# EAGLE design battery_monitor_6803-2_Rev2 (EAGLE 7.3.0)
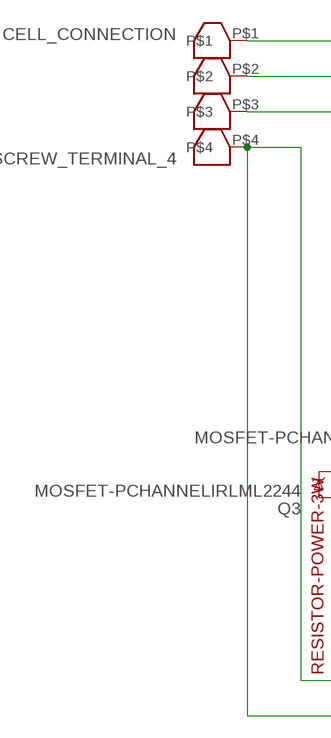
[diagram p0: schematic, sheet 1, part 1 of 2]
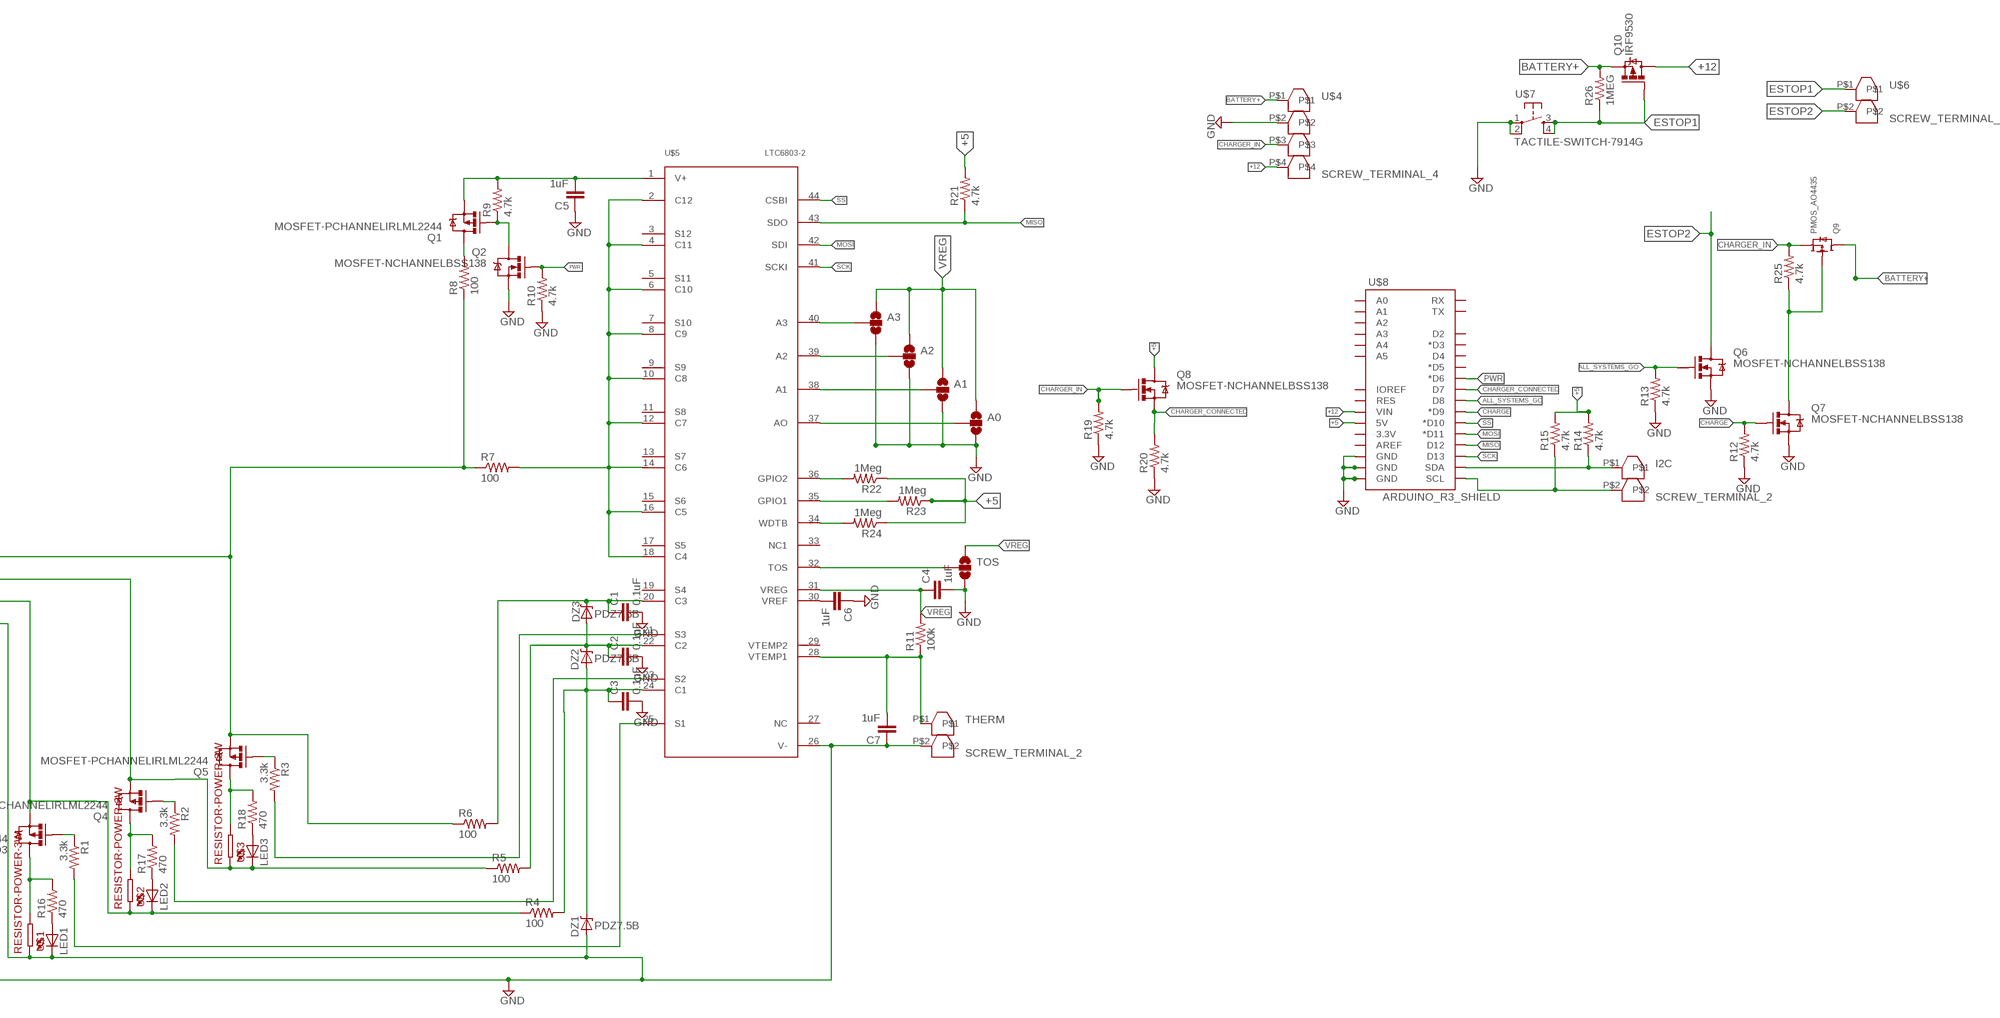
[diagram p1: schematic, sheet 1, part 2 of 2]

## Parts
A0  SOLDERJUMPER_2WAYS  [SJ_3]
A1  SOLDERJUMPER_2WAYS  [SJ_3]
A2  SOLDERJUMPER_2WAYS  [SJ_3]
A3  SOLDERJUMPER_2WAYS  [SJ_3]
C1  0.1uF  0.1UF-100V-10%(0603)  [0603-CAP]
C2  0.1uF  0.1UF-100V-10%(0603)  [0603-CAP]
C3  0.1uF  0.1UF-100V-10%(0603)  [0603-CAP]
C4  1uF  0.1UF-100V-10%(0603)  [0603-CAP]
C5  1uF  0.1UF-100V-10%(0603)  [0603-CAP]
C6  1uF  0.1UF-100V-10%(0603)  [0603-CAP]
C7  1uF  0.1UF-100V-10%(0603)  [0603-CAP]
CELL_CONNECTION  SCREW_TERMINAL_4  [SCREW_TERMINAL_4]
DZ1  PDZ7.5B  DIODE-ZENER-BZT52  [SOD-323]
DZ2  PDZ7.5B  DIODE-ZENER-BZT52  [SOD-323]
DZ3  PDZ7.5B  DIODE-ZENER-BZT52  [SOD-323]
I2C  SCREW_TERMINAL_2  [SCREW_TERMINAL_2]
LED1  LED0603  [LED-0603]
LED2  LED0603  [LED-0603]
LED3  LED0603  [LED-0603]
Q1  MOSFET-PCHANNELIRLML2244  [SOT23-3]
Q2  MOSFET-NCHANNELBSS138  [SOT23]
Q3  MOSFET-PCHANNELIRLML2244  [SOT23-3]
Q4  MOSFET-PCHANNELIRLML2244  [SOT23-3]
Q5  MOSFET-PCHANNELIRLML2244  [SOT23-3]
Q6  MOSFET-NCHANNELBSS138  [SOT23]
Q7  MOSFET-NCHANNELBSS138  [SOT23]
Q8  MOSFET-NCHANNELBSS138  [SOT23]
Q9  PMOS_AO4435  [SOIC8]
Q10  IRF9530  [TO220BV]
R1  3.3k  3.3KOHM1/10W1%(0603)  [0603-RES]
R2  3.3k  3.3KOHM1/10W1%(0603)  [0603-RES]
R3  3.3k  3.3KOHM1/10W1%(0603)  [0603-RES]
R4  100  3.3KOHM1/10W1%(0603)  [0603-RES]
R5  100  3.3KOHM1/10W1%(0603)  [0603-RES]
R6  100  3.3KOHM1/10W1%(0603)  [0603-RES]
R7  100  3.3KOHM1/10W1%(0603)  [0603-RES]
R8  100  3.3KOHM1/10W1%(0603)  [0603-RES]
R9  4.7k  3.3KOHM1/10W1%(0603)  [0603-RES]
R10  4.7k  3.3KOHM1/10W1%(0603)  [0603-RES]
R11  100k  3.3KOHM1/10W1%(0603)  [0603-RES]
R12  4.7k  3.3KOHM1/10W1%(0603)  [0603-RES]
R13  4.7k  3.3KOHM1/10W1%(0603)  [0603-RES]
R14  4.7k  3.3KOHM1/10W1%(0603)  [0603-RES]
R15  4.7k  3.3KOHM1/10W1%(0603)  [0603-RES]
R16  470  3.3KOHM1/10W1%(0603)  [0603-RES]
R17  470  3.3KOHM1/10W1%(0603)  [0603-RES]
R18  470  3.3KOHM1/10W1%(0603)  [0603-RES]
R19  4.7k  3.3KOHM1/10W1%(0603)  [0603-RES]
R20  4.7k  3.3KOHM1/10W1%(0603)  [0603-RES]
R21  4.7k  3.3KOHM1/10W1%(0603)  [0603-RES]
R22  1Meg  3.3KOHM1/10W1%(0603)  [0603-RES]
R23  1Meg  3.3KOHM1/10W1%(0603)  [0603-RES]
R24  1Meg  3.3KOHM1/10W1%(0603)  [0603-RES]
R25  4.7k  3.3KOHM1/10W1%(0603)  [0603-RES]
R26  1MEG  3.3KOHM1/10W1%(0603)  [0603-RES]
THERM  SCREW_TERMINAL_2  [SCREW_TERMINAL_2]
TOS  SOLDERJUMPER_2WAYS  [SJ_3]
U$1  RESISTOR-POWER-3W  [RESISTOR-3W]
U$2  RESISTOR-POWER-3W  [RESISTOR-3W]
U$3  RESISTOR-POWER-3W  [RESISTOR-3W]
U$4  SCREW_TERMINAL_4  [SCREW_TERMINAL_4]
U$5  LTC6803-2  [FSOP-44]
U$6  SCREW_TERMINAL_2  [SCREW_TERMINAL_2]
U$7  TACTILE-SWITCH-7914G  [7914G]
U$8  ARDUINO_R3_SHIELD  [UNO_R3_SHIELD]

## Nets
+5: Q8.3(D) R14.2 R15.2 R21.2 R22.1 R23.1 R24.1 U$8.5V
+12: Q10.D U$4.P$4 U$8.VIN
ALL_SYSTEMS_GO: Q6.1(G) R13.2 U$8.D8
BATTERY+: Q9.5(DRAIN) Q9.6(DRAIN) Q9.7(DRAIN) Q9.8(DRAIN) Q10.S R26.2 U$4.P$1
CHARGE: Q7.1(G) R12.2 U$8.D9(*D9)
CHARGER_CONNECTED: Q8.2(S) R20.2 U$8.D7
CHARGER_IN: Q8.1(G) Q9.1(SOURCE) Q9.2(SOURCE) Q9.3(SOURCE) R19.2 R25.2 U$4.P$3
ESTOP1: Q10.G R26.1 U$6.P$1 U$7.3 U$7.4
ESTOP2: Q6.3(D) U$6.P$2
GND: A0.3 A1.3 A2.3 A3.3 C1.2 C2.2 C3.2 C4.2 C5.1 C6.1 C7.1 CELL_CONNECTION.P$4 DZ1.2(A) LED1.C Q2.2(S) Q6.2(S) Q7.2(S) R10.1 R12.1 R13.1 R19.1 R20.1 THERM.P$2 TOS.3 U$1.P$2 U$4.P$2 U$5.26(V-) U$7.1 U$7.2 U$8.GND@0(GND) U$8.GND@1(GND) U$8.GND@2(GND)
MISO: R21.1 U$5.43(SDO) U$8.D12
MOSI: U$5.42(SDI) U$8.D11(*D11)
N$1: Q7.3(D) Q9.4(GATE) R25.1
N$2: CELL_CONNECTION.P$3 LED2.C Q3.2(S) R4.1 U$2.P$2
N$3: CELL_CONNECTION.P$2 LED3.C Q4.2(S) R5.1 U$3.P$2
N$4: CELL_CONNECTION.P$1 Q5.2(S) R6.1 R7.1 R8.1
N$5: Q3.3(D) R16.2 U$1.P$1
N$6: R2.2 U$5.23(S2)
N$7: Q3.1(G) R1.1
N$8: R1.2 U$5.25(S1)
N$9: R3.2 U$5.21(S3)
N$10: Q4.3(D) R17.2 U$2.P$1
N$11: Q4.1(G) R2.1
N$12: Q5.3(D) R18.2 U$3.P$1
N$13: LED1.A R16.1
N$14: C1.1 DZ3.1(C) R6.2 U$5.20(C3)
N$15: C3.1 DZ1.1(C) DZ2.2(A) R4.2 U$5.24(C1)
N$16: C2.1 DZ2.1(C) DZ3.2(A) R5.2 U$5.22(C2)
N$17: R7.2 U$5.2(C12) U$5.4(C11) U$5.6(C10) U$5.8(C9) U$5.10(C8) U$5.12(C7) U$5.14(C6) U$5.16(C5) U$5.18(C4)
N$18: Q1.3(D) R8.2
N$19: C5.2 Q1.2(S) R9.2 U$5.1(V+)
N$20: Q1.1(G) Q2.3(D) R9.1
N$21: C7.2 R11.1 THERM.P$1 U$5.28(VTEMP1)
N$22: LED2.A R17.1
N$23: LED3.A R18.1
N$24: R22.2 U$5.36(GPIO2)
N$25: R23.2 U$5.35(GPIO1)
N$27: R24.2 U$5.34(WDTB)
N$28: A3.2 U$5.40(A3)
N$29: Q5.1(G) R3.1
N$30: A2.2 U$5.39(A2)
N$31: A1.2 U$5.38(A1)
N$32: A0.2 U$5.37(AO)
N$33: TOS.2 U$5.32(TOS)
N$34: C6.2 U$5.30(VREF)
PWR: Q2.1(G) R10.2 U$8.D6(*D6)
SCK: U$5.41(SCKI) U$8.D13
SCL: I2C.P$2 R15.1 U$8.SCL
SDA: I2C.P$1 R14.1 U$8.SDA
SS: U$5.44(CSBI) U$8.D10(*D10)
VREG: A0.1 A1.1 A2.1 A3.1 C4.1 R11.2 TOS.1 U$5.31(VREG)
Unconnected: U$5.3(S12) U$5.5(S11) U$5.7(S10) U$5.9(S9) U$5.11(S8) U$5.13(S7) U$5.15(S6) U$5.17(S5) U$5.19(S4) U$5.27(NC) U$5.29(VTEMP2) U$5.33(NC1) U$8.3.3V U$8.A0 U$8.A1 U$8.A2 U$8.A3 U$8.A4 U$8.A5 U$8.AREF U$8.D2 U$8.D3(*D3) U$8.D4 U$8.D5(*D5) U$8.IOREF U$8.RES U$8.RX U$8.TX

## Library data of the parts
A0 A1-A3 TOS = SparkFun:SOLDERJUMPER_2WAY: Solder Jumper 2 way solder jumper; OC_NEWARK: unknown
C1-C3 = SparkFun-Capacitors:0.1UF-100V-10%(0603): CAP-08390; MF: AVX CORPORATION; MPN: 0603YG104ZAT2A; OC_NEWARK: 01H6821; PROD_ID: CAP-08390
C4-C7 = SparkFun-Capacitors:0.1UF-100V-10%(0603): CAP-08390; MPN: C0603X5R0J105M030BC; OC_NEWARK: 04X3184; PROD_ID: CAP-08390; VALUE: 0.1uF
CELL_CONNECTION U$4 = isaac1:SCREW_TERMINAL_4; MF: TYCO ELECTRONICS; MPN: 282834-4; OC_NEWARK: 12H8388
DZ1-DZ3 = SparkFun-DiscreteSemi:DIODE-ZENER: Zener Diode Production Part - 8199 3.4V Zener Voltage; MPN: PDZ7.5B,115; OC_NEWARK: 04X4941
I2C THERM = isaac1:SCREW_TERMINAL_2; MF: TYCO ELECTRONICS; MPN: 282834-2; OC_NEWARK: 12H8386
LED1-LED3 = SparkFun-LED:LED: LEDs Standard schematic elements and footprints for 5mm, 3mm, 1206, and 0603 sized LEDs. 5mm - Spark Fun Electronics SKU : COM-00529 (and others); MPN: 150060RS75000; OC_NEWARK: 95W3795
Q1 Q3-Q5 = SparkFun-DiscreteSemi:MOSFET-PCHANNEL: Generic PMOSFET; MPN: SI2369DS-T1-GE3; OC_NEWARK: 40X8697; PROD_ID: TRANS-11153
Q2 Q6-Q8 = SparkFun-DiscreteSemi:MOSFET-NCHANNEL: Common NMOSFET Parts MFG P/N Store ID Prod ID FDD8780 TRANS-09984 SI7820DN TRANS-11055 FDS6630A IC-08089 2N7002PW TRANS-11151 FQP30N06L COM-10213 TRANS-10060 BSS123LT1G TRANS-08345 BSS138 TRANS-00830 BS170 2N7000; MPN: IRLML0030TRPBF; OC_NEWARK: 52R2613; PROD_ID: TRANS-00830
Q9 = isaac1:PMOS_AO4435; MPN: SI9407BDY-T1-GE3; OC_NEWARK: 16P3885
Q10 = Adams Chips:IRF9530: P-CHANNEL HEXFET POWER-MOS-FET Source: http://www.irf.com/product-info/datasheets/data/irf9530.pdf; MPN: NTE2383; OC_NEWARK: 14T4215
R1-R3 = SparkFun-Resistors:3.3KOHM1/10W1%(0603): RES-07851; MF: VISHAY/DALE; MPN: CRCW06033K00FKEA; OC_NEWARK: 52K8368; PROD_ID: RES-07851
R4-R8 = SparkFun-Resistors:3.3KOHM1/10W1%(0603): RES-07851; MPN: ERJ-1GNF1000C; OC_NEWARK: 05X8794; PROD_ID: RES-07851
R9 R10 R12-R15 R19-R21 R25 = SparkFun-Resistors:3.3KOHM1/10W1%(0603): RES-07851; MF: VISHAY/DALE; MPN: CRCW06034K70FKEA; OC_NEWARK: 52K8494; PROD_ID: RES-07851
R11 = SparkFun-Resistors:3.3KOHM1/10W1%(0603): RES-07851; MF: FARNELL; MPN: MC0063W06035100K; OC_NEWARK: 39K0075; PROD_ID: RES-07851
R16-R18 = SparkFun-Resistors:3.3KOHM1/10W1%(0603): RES-07851; MPN: ERJ-P03F4700V; OC_NEWARK: 05X8640; PROD_ID: RES-07851
R22-R24 R26 = SparkFun-Resistors:3.3KOHM1/10W1%(0603): RES-07851; MPN: ERJ-3EKF1004V; OC_NEWARK: 64R5311; PROD_ID: RES-07851
U$1-U$3 = isaac1:RESISTOR-POWER-3W: PR03 series .205" dia x .657" L; MPN: ERG-3SJ200; OC_NEWARK: 52W7905
U$5 = isaac1:LTC6803-2; OC_NEWARK: unknown
U$6 = Isaac:SCREW_TERMINAL_2; MF: TYCO ELECTRONICS; MPN: 282834-2; OC_NEWARK: 12H8386
U$7 = GeekAmmo:TACTILE-SWITCH: Tactile Switch 4 Pins, SPST NO; MF: BOURNS, INC.; MPN: 7914G-1-000E; OC_NEWARK: 05B2757
U$8 = SparkFun-Boards:ARDUINO_R3_SHIELD: Shield form compatible with the Arduino Uno R3.; OC_NEWARK: unknown

## Board
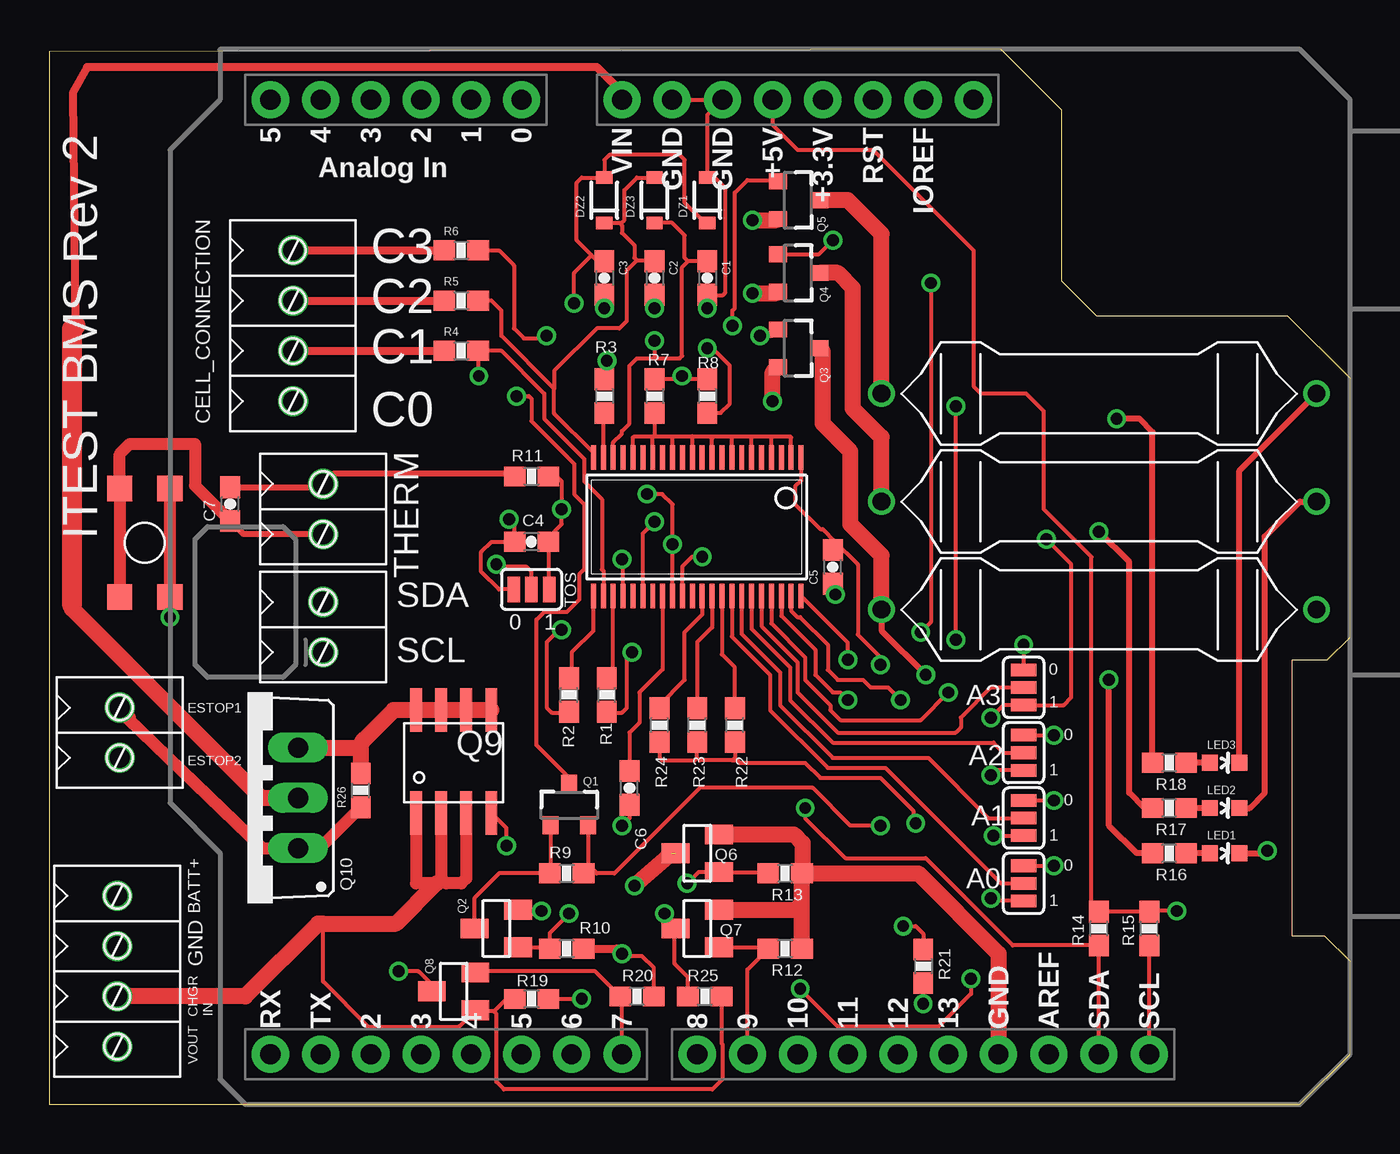
[diagram p2: board, top side]
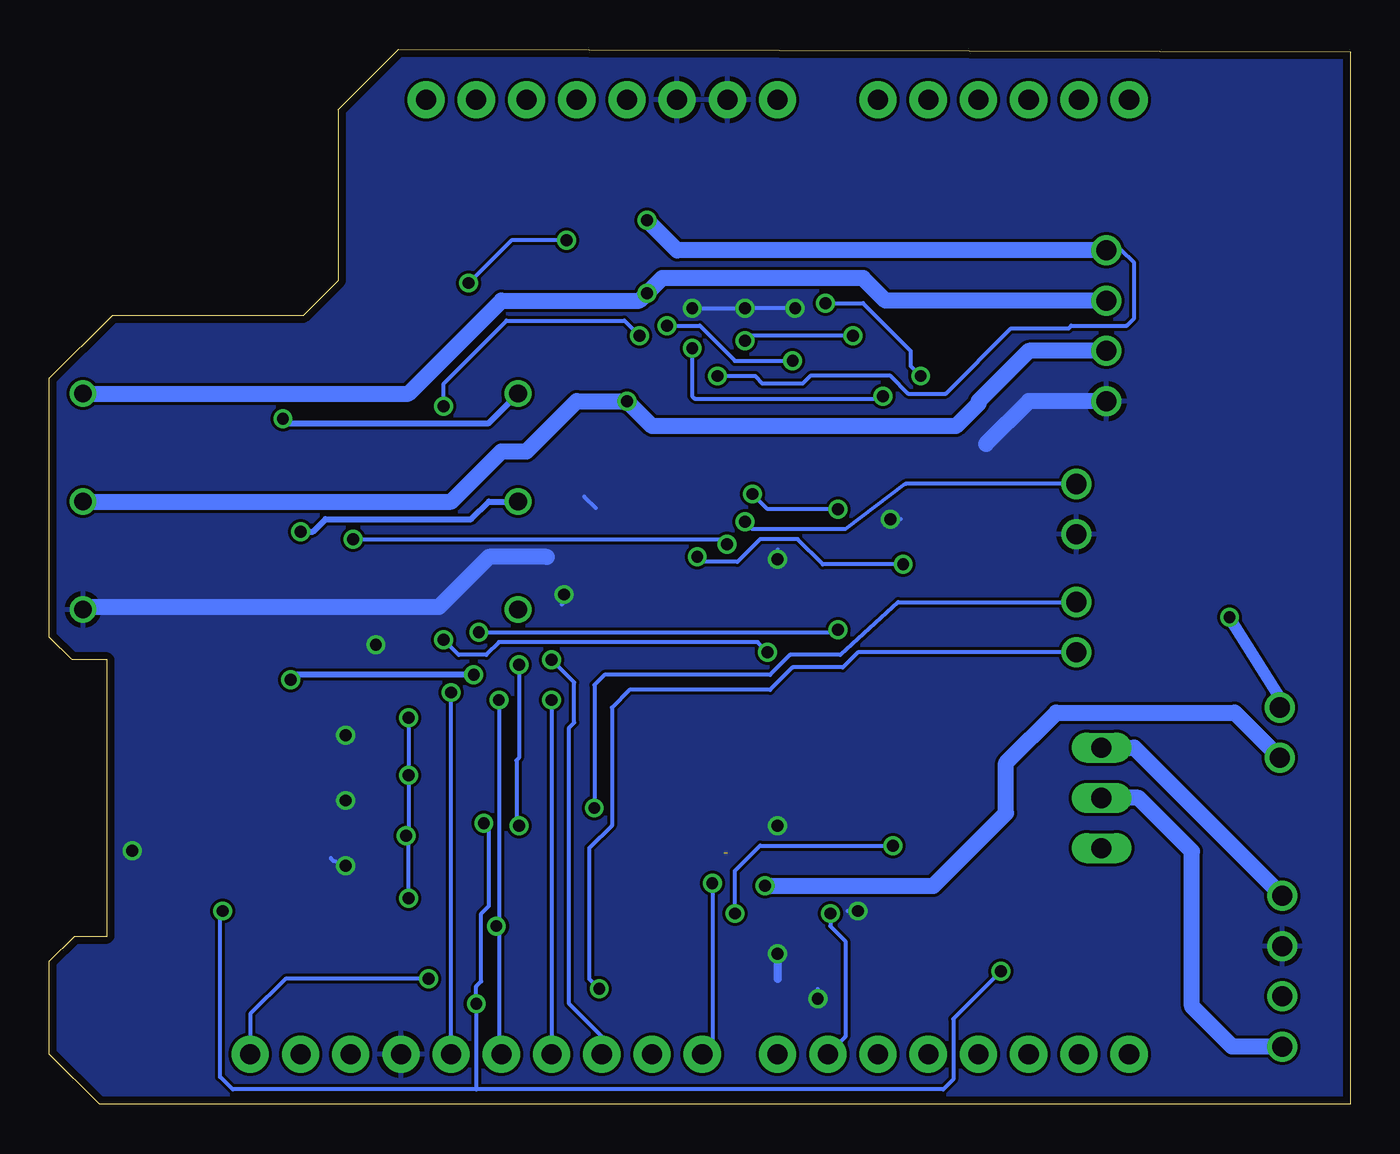
[diagram p3: board, bottom side, seen from below]

Size 65.79 x 53.34 mm. Coordinates in mm from the lower left corner, seen from the top.
Outline: 0,0 63.25,0 65.79,2.54 65.79,7.24 64.52,8.51 62.86,8.51 62.86,22.48 64.64,22.48 65.79,23.62 65.79,36.7 62.61,39.88 52.96,39.88 51.18,41.66 51.18,50.29 48.13,53.34 0,53.21 0,0
Copper layers (1*16): Top 0.0356mm / dielectric 1.5011mm / Bottom 0.0356mm
Design rules "LaenPCBOrder": minimum track width 6mil, minimum drill 13mil, track to track 6mil, track to pad 6mil, pad to pad 6mil, via to via 6mil, smd to smd 6mil, copper to edge 15mil, drill to drill 6mil, minimum pad ring 7mil, minimum via ring 7mil, stop-mask expansion 3mil, vias tented up to drill 0mil, thermal gap 10mil

### Footprints (pad centres in the part's own frame; a part is rotated, then mirrored left to right if it is on the bottom)
SJ_3 = smd 0.635 x 1.27: 1 -0.889,0; 2 0,0; 3 0.889,0
0603-CAP = smd 1.1 x 1: 1 -0.85,0; 2 0.85,0
SCREW_TERMINAL_4 = drill 1.016 pad 1.422: P$1 0,3.81; P$2 0,1.27; P$3 0,-1.27; P$4 0,-3.81
SOD-323 = smd 0.63 x 0.83: 1 -1.15,0; 2 1.15,0
SCREW_TERMINAL_2 = drill 1.016 pad 1.422: P$1 0,1.27; P$2 0,-1.27
LED-0603 = smd 0.8 x 0.8: A 0,-0.75; C 0,0.75
SOT23-3 = smd 0.8 x 0.9: 1 -0.95,-1; 2 0.95,-1; 3 0,1.1
SOT23 = smd 1 x 1.4: 1 -0.95,-1.1; 2 0.95,-1.1; 3 0,1.1
SOIC8 = smd 0.6 x 2.2: 1 -1.905,-2.54; 2 -0.635,-2.54; 3 0.635,-2.54; 4 1.905,-2.54; 5 1.905,2.66; 6 0.635,2.66; 7 -0.635,2.66; 8 -1.905,2.66
TO220BV = drill 1.016 long: D 0,-2.54; G -2.54,-2.54; S 2.54,-2.54
0603-RES = smd 1.1 x 1: 1 -0.85,0; 2 0.85,0
RESISTOR-3W = drill 0.9: P$1 0,11; P$2 0,-11
FSOP-44 = smd 0.25 x 1.25: 1 -5.25,-3.5; 2 -4.75,-3.5; 3 -4.25,-3.5; 4 -3.75,-3.5; 5 -3.25,-3.5; 6 -2.75,-3.5; 7 -2.25,-3.5; 8 -1.75,-3.5; 9 -1.25,-3.5; 10 -0.75,-3.5; 11 -0.25,-3.5; 12 0.25,-3.5; 13 0.75,-3.5; 14 1.25,-3.5; 15 1.75,-3.5; 16 2.25,-3.5; 17 2.75,-3.5; 18 3.25,-3.5; 19 3.75,-3.5; 20 4.25,-3.5; 21 4.75,-3.5; 22 5.25,-3.5; 23 5.25,3.5; 24 4.75,3.5; 25 4.25,3.5; 26 3.75,3.5; 27 3.25,3.5; 28 2.75,3.5; 29 2.25,3.5; 30 1.75,3.5; 31 1.25,3.5; 32 0.75,3.5; 33 0.25,3.5; 34 -0.25,3.5; 35 -0.75,3.5; 36 -1.25,3.5; 37 -1.75,3.5; 38 -2.25,3.5; 39 -2.75,3.5; 40 -3.25,3.5; 41 -3.75,3.5; 42 -4.25,3.5; 43 -4.75,3.5; 44 -5.25,3.5
7914G = smd 1.27 x 1.27: 1 0,0; 2 0,5.486; 3 2.54,0; 4 2.54,5.486
UNO_R3_SHIELD = drill 1.016 pad 1.88: 3.3V 50.8,26.67; 5V 50.8,29.21; A0 50.8,41.91; A1 50.8,44.45; A2 50.8,46.99; A3 50.8,49.53; A4 50.8,52.07; A5 50.8,54.61; AREF 2.54,15.24; D2 2.54,49.53; D3 2.54,46.99; D4 2.54,44.45; D5 2.54,41.91; D6 2.54,39.37; D7 2.54,36.83; D8 2.54,33.02; D9 2.54,30.48; D10 2.54,27.94; D11 2.54,25.4; D12 2.54,22.86; D13 2.54,20.32; GND@0 50.8,31.75; GND@1 50.8,34.29; GND@2 2.54,17.78; IOREF 50.8,21.59; NC 50.8,19.05; RES 50.8,24.13; RX 2.54,54.61; SCL 2.54,10.16; SDA 2.54,12.7; TX 2.54,52.07; VIN 50.8,36.83

### Placement (x,y rotation side)
A0  49.28,11.18 90 top
A1  49.28,14.48 90 top
A2  49.28,17.78 90 top
A3  49.28,21.08 90 top
C1  33.27,41.78 270 top
C2  30.61,41.78 270 top
C3  28.07,41.78 270 top
C4  24.38,28.45 180 top
C5  39.62,27.18 90 top
C6  29.34,16 90 top
C7  9.14,30.35 90 top
CELL_CONNECTION  12.32,39.37 0 top
DZ1  33.27,45.72 90 top
DZ2  28.07,45.72 90 top
DZ3  30.61,45.72 90 top
I2C  13.84,24.13 0 top
LED1  59.44,12.7 270 top
LED2  59.44,14.99 270 top
LED3  59.44,17.27 270 top
Q1  26.29,15.11 0 top
Q2  22.61,8.89 90 top
Q3  37.85,38.23 270 top
Q4  37.85,42.04 270 top
Q5  37.85,45.72 270 top
Q6  32.77,12.7 90 top
Q7  32.77,8.89 90 top
Q8  20.45,5.71 90 top
Q9  20.45,17.27 0 top
Q10  10.03,15.49 90 top
R1  28.19,20.7 90 top
R2  26.29,20.7 90 top
R3  28.07,35.81 270 top
R4  20.83,38.1 0 top
R5  20.83,40.64 0 top
R6  20.83,43.18 0 top
R7  30.61,35.81 270 top
R8  33.27,35.81 270 top
R9  26.16,11.68 0 top
R10  26.16,7.87 180 top
R11  24.38,31.75 0 top
R12  37.21,7.87 180 top
R13  37.21,11.68 180 top
R14  53.09,8.89 90 top
R15  55.63,8.89 90 top
R16  56.64,12.7 180 top
R17  56.64,14.99 180 top
R18  56.64,17.27 180 top
R19  24.38,5.33 180 top
R20  29.72,5.46 180 top
R21  44.2,6.98 270 top
R22  34.67,19.18 90 top
R23  32.77,19.18 90 top
R24  30.86,19.18 90 top
R25  33.15,5.46 0 top
R26  15.75,15.88 90 top
THERM  13.84,30.1 0 top
TOS  24.38,26.04 180 top
U$1  53.09,25.02 90 top
U$2  53.09,30.48 90 top
U$3  53.09,35.94 90 top
U$4  3.43,6.73 0 top
U$5  32.77,29.21 180 top
U$6  3.56,18.8 0 top
U$7  3.56,25.65 0 top
U$8  65.79,0 90 top

### Tracks (layer width: path | path; a pad name or v marks a point on that pad's centre or on a via)
+5  (via drill 0.6)
  Top 0.203: U$8.5V 36.58,49.53 37.85,48.26 41.66,48.26 46.74,43.18 46.74,36.32 47.12,35.94 49.4,35.94 50.29,35.05 50.29,30.1 52.7,27.69 52.7,10.12 R14.2 R15.2 55.66,9.78 v57.02,9.78 | Q8.3 19.35,6.05 18.67,6.73 v17.65,6.73 | R21.2 v44.2,5.08 | R24.1 30.86,17.53 30.99,17.4 32.64,17.4 32.77,17.53 | 32.77,17.53 R23.1 | R22.1 34.67,17.53 34.54,17.4 | 34.54,17.4 32.89,17.4 32.77,17.53 | 34.54,17.4 34.8,17.4 34.92,17.27 38.23,17.27 38.99,16.51 42.04,16.51 43.69,14.86 43.69,14.35 v43.81,14.22
  Bottom 0.203: v57.02,9.78 57.15,9.65 57.15,1.4 56.52,0.76 44.2,0.76 | 44.2,0.76 20.57,0.76 20.07,1.27 20.07,4.32 v17.65,6.73 | 44.2,0.76 v44.2,5.08 44.2,5.97 43.94,6.22 43.94,9.65 43.56,10.03 43.56,13.97 v43.81,14.22
+12
  Top 0.406: U$8.VIN 28.96,51.18 27.69,52.45 1.9,52.45 1.19,51.14 1.31,39.37
  Top 0.813: Q10.D 10.71,15.49 1.14,25.06 1.14,25.27
  Top 1.016: 1.14,25.27 1.14,39.2 1.31,39.37
  Bottom 0.813: U$4.P$4 5.97,2.92 8,4.95 8,12.79 10.71,15.49 Q10.D
ALL_SYSTEMS_GO  (via drill 0.6)
  Top 0.203: 36.3,11.75 Q6.1 32.83,11.75 v32.26,11.18
  Top 0.813: 36.3,11.75 R13.2
  Bottom 0.203: v32.26,11.18 32.26,3.05 U$8.D8
BATTERY+
  Top 0.813: Q9.5 Q9.6 Q9.7 Q9.8 arc45 18.52,19.94 17.4,19.94 15.93,18.47 arc45 15.75,18.02 | 15.75,18.02 R26.2 | Q10.S arc45 12.59,18.02 15.75,18.02
  Bottom 0.813: Q10.S 10.92,18.03 U$4.P$1
CHARGE
  Top 0.203: Q7.1 36.3,7.94 R12.2 35.31,6.82 U$8.D9
CHARGER_CONNECTED
  Top 0.203: U$8.D7 28.96,5.37 R20.2 27.6,6.73 21.61,6.73 Q8.2
CHARGER_IN
  Top 0.203: R19.2 23.11,5.33 22.48,4.7 | 22.48,4.7 21.61,4.7 Q8.1 | R25.2 34,3.09 34.04,3.05 34.04,1.27 33.53,0.76 22.99,0.76 22.61,1.14 22.61,4.57 22.48,4.7 | Q8.1 21.49,4.83 | 13.84,9.14 13.84,6.22 16.13,3.94 20.72,3.94 Q8.1
  Top 0.406: 21.49,4.83 21.46,4.83
  Top 0.61: Q9.1 18.54,11.18 19.56,11.18 19.81,11.43 | Q9.2 19.81,11.43 | Q9.3 21.08,11.43 20.83,11.18 20.07,11.18 19.81,11.43
  Top 0.813: U$4.P$3 9.91,5.46 13.59,9.14 13.84,9.14 17.53,9.14 19.56,11.18
ESTOP1  (via drill 0.6)
  Top 0.61: R26.1 13.68,12.95 Q10.G 10.8,12.95 3.94,19.56 4.06,19.56 U$6.P$1 | U$7.4 U$7.3 v6.1,24.64
  Bottom 0.61: U$6.P$1 3.56,20.57 v6.1,24.64
ESTOP2  (via drill 0.6)  (1 unrouted)
  Top 0.813: 31.5,12.7 v29.59,11.05
  Bottom 0.61: U$6.P$2 3.81,17.78
  Bottom 0.813: U$6.P$2 5.84,19.81 14.86,19.81 17.4,17.27 17.4,14.73 21.08,11.05 v29.59,11.05
GND  (via drill 0.6)
  Top 0.203: C3.2 v28.07,40.26 | v30.61,40.26 C2.2 | v33.27,40.26 C1.2 33.31,40.89 34.04,40.89 34.16,41.02 34.16,46.35 33.65,46.87 DZ1.2 33.27,50.04 U$8.GND@0 U$8.GND@1 | Q2.2 23.89,9.65 24.77,9.65 v24.89,9.78 | R19.1 v26.92,5.33 | R20.1 30.57,6.9 29.97,7.49 29.08,7.49 v28.96,7.62 | U$5.26 29.02,27.5 v28.96,27.56 | A0.3 v50.8,12.06 | A1.3 v50.8,15.37 | A2.3 v50.8,18.67 | A3.3 v49.28,23.24 | C5.1 39.62,25.91 v39.75,25.78 | v23.24,29.59 23.53,29.3 C4.2 22.35,28.45 21.84,27.94 21.84,26.92 22.73,26.04 TOS.3 | C6.1 29.34,14.48 v28.96,14.1
  Top 0.305: LED1.C 61.47,12.7 v61.59,12.83 | THERM.P$2 9.82,28.83 C7.1
  Top 0.406: R10.1 28.7,7.87 v28.96,7.62
  Top 0.61: U$7.1 U$7.2 3.56,32.89 4.06,33.4 7.37,33.4 7.37,31.28 C7.1
  Top 0.813: R13.1 43.94,11.68 48.01,7.62 U$8.GND@2 | R12.1 38.06,10.16 | 38.06,10.16 R13.1 | Q7.2 37.74,9.84 38.06,10.16 | Q6.2 37.66,13.65 38.1,13.21 38.1,11.72 R13.1
  Bottom 0.203: v28.07,40.26 v30.61,40.26 v33.27,40.26 | 38.73,30.73 38.16,30.16 | v26.92,5.33 26.92,5.84 | v28.96,27.56 28.96,28.07 | v50.8,12.06 51.44,12.32 51.56,12.45 | v50.8,15.37 51.18,15.37 | v50.8,18.67 50.93,18.67 50.8,18.8 | v49.28,23.24 49.28,23.62 | v39.75,25.78 39.75,25.4 39.88,25.27 | v23.24,29.59 22.73,29.59 | v28.96,14.1 28.96,13.72 | v24.89,9.78 25.4,9.78
  Bottom 0.406: v28.96,7.62 28.96,6.35
  Bottom 0.813: CELL_CONNECTION.P$4 16.26,35.56 18.41,33.4 | 40.64,27.69 43.56,27.69 46.1,25.15 63.96,25.15 U$1.P$2
  pour Bottom: -0.89,-1.02 65.79,-1.27 65.79,54.61 -0.89,54.61
MISO  (via drill 0.6)
  Top 0.203: v43.05,20.45 42.42,21.08 41.53,21.08 41.15,21.46 39.88,21.46 39.37,21.97 39.37,23.24 37.97,24.64 37.85,24.64 37.52,24.97 U$5.43 | v43.18,9.02 43.81,9.02 44.2,8.64 R21.1
  Bottom 0.203: v43.05,20.45 43.05,9.14 | 43.05,9.14 43.05,2.67 U$8.D12 | v43.18,9.02 43.05,9.14
MOSI  (via drill 0.6)
  Top 0.203: v40.39,20.45 40.01,20.83 39.62,20.83 38.73,21.72 38.73,22.99 37.02,24.71 U$5.42
  Bottom 0.203: v40.39,20.45 U$8.D11
N$1  (via drill 0.6)
  Top 0.203: R25.1 32.3,6.44 31.62,7.11 31.62,8.85 | 31.62,8.85 Q7.3 | 31.62,8.85 31.62,9.14 v31.12,9.65 | v23.11,13.08 23.11,13.97 Q9.4
  Bottom 0.203: v31.12,9.65 31.12,11.81 29.84,13.08 v23.11,13.08
N$2  (via drill 0.6)
  Top 0.305: LED2.C 60.71,14.99 61.47,15.75 61.47,28.7 63.25,30.48 U$2.P$2
  Top 0.406: CELL_CONNECTION.P$3 R4.1
  Top 0.813: v36.58,35.56 36.58,37.01 Q3.2
  Bottom 0.813: CELL_CONNECTION.P$3 16.26,38.1 18.8,35.56 18.8,35.43 19.94,34.29 35.31,34.29 v36.58,35.56 39.12,35.56 41.66,33.02 42.93,33.02 45.47,30.48 U$2.P$2
N$3  (via drill 0.6)
  Top 0.305: LED3.C 60.19,32.04 U$3.P$2
  Top 0.406: CELL_CONNECTION.P$2 R5.1
  Top 0.813: v35.56,41.02 36.78,41.02 Q4.2
  Bottom 0.813: CELL_CONNECTION.P$2 23.49,40.64 24.64,41.78 34.8,41.78 v35.56,41.02 | 35.43,41.15 v35.56,41.02 | U$3.P$2 47.62,35.94 42.93,40.64 35.94,40.64 v35.56,41.02
N$4  (via drill 0.6)
  Top 0.203: R7.1 R8.1 32.17,36.66 v32,36.83
  Top 0.406: CELL_CONNECTION.P$1 R6.1
  Top 0.813: v35.56,44.7 36.78,44.7 Q5.2
  Bottom 0.203: v32,36.83 30.1,36.83 29.72,36.45 27.69,36.45 27.3,36.83 23.24,36.83 22.35,35.94 20.45,35.94 17.14,39.24 14.22,39.24 14.1,39.37 11.3,39.37 10.92,39.75 10.92,42.55 11.56,43.18 CELL_CONNECTION.P$1
  Bottom 0.813: CELL_CONNECTION.P$1 34.04,43.18 v35.56,44.7
N$5  (via drill 0.6)
  Top 0.305: R16.2 54.99,12.7 53.59,14.1 v53.59,21.46 | U$1.P$1 42.09,23.95 v44.32,21.72
  Top 0.813: U$1.P$1 42.09,27.76 40.51,29.34 40.51,33.02 39.12,34.42 39.12,38.06 Q3.3
  Bottom 0.305: v44.32,21.72 53.34,21.72 v53.59,21.46
N$6
  Top 0.203: R2.2 26.42,21.68 26.42,22.86 27.52,23.96 U$5.23
N$7  (via drill 0.6)
  Top 0.203: v45.85,23.5 v45.85,35.31 | v35.94,38.86 36.53,38.86 Q3.1 | R1.1 28.49,19.81 28.96,19.81 29.21,20.07 29.21,22.61 v29.46,22.86
  Bottom 0.203: v45.85,23.5 45.09,22.73 43.69,22.73 43.05,23.37 29.97,23.37 v29.46,22.86 | v45.85,35.31 45.85,36.45 42.67,39.62 36.7,39.62 v35.94,38.86
N$8
  Top 0.203: R1.2 28.52,21.62 U$5.25
N$9
  Top 0.203: U$5.21 28.02,34.91 R3.2
N$10  (via drill 0.6)
  Top 0.305: R17.2 55.37,14.99 54.61,15.75 54.61,27.43 v53.09,28.96
  Top 0.813: U$2.P$1 42.09,33.73 40.64,35.18 40.64,41.27 39.88,42.04 Q4.3
  Bottom 0.305: v53.09,28.96 52.45,28.96 51.82,29.59 44.45,29.59 43.56,30.48 U$2.P$1
N$11  (via drill 0.6)
  Top 0.203: Q4.1 38.92,42.99 v39.62,43.69 | v44.58,41.53 44.58,24.38 v44.07,23.88 | v25.91,24 25.78,24 25.15,23.37 25.15,20.07 25.4,19.81 26.25,19.81 R2.1
  Bottom 0.203: v39.62,43.69 42.42,43.69 v44.58,41.53 | v44.07,23.88 26.04,23.88 v25.91,24
N$12  (via drill 0.6)
  Top 0.305: R18.2 55.79,34 55.12,34.67 v53.98,34.67
  Top 0.813: U$3.P$1 42.09,44.02 40.39,45.72 Q5.3
  Bottom 0.305: U$3.P$1 43.61,34.42 53.72,34.42 v53.98,34.67
N$13
  Top 0.305: LED1.A R16.1
N$14  (via drill 0.6)
  Top 0.203: C1.1 32.3,42.63 | 32.3,42.63 32.13,42.8 32.13,43.94 31.5,44.58 DZ3.1 | 32.3,42.63 32,42.34 32,37.85 31.88,37.72 30.73,37.72 | 30.73,37.72 29.72,37.72 29.34,37.34 29.34,34.42 28.96,34.04 28.96,33.91 28.52,33.47 U$5.20 | R6.2 22.73,43.18 23.49,42.42 23.49,39.24 24,38.73 25.02,38.73 v25.15,38.86 | v30.61,38.61 30.61,37.85 30.73,37.72
  Bottom 0.203: v25.15,38.86 30.35,38.86 v30.61,38.61
N$15  (via drill 0.6)
  Top 0.203: DZ1.1 33.15,44.57 32.13,45.59 32.13,47.75 31.88,48.01 28.32,48.01 28.07,47.75 DZ2.2 26.92,46.86 26.67,46.61 26.67,43.69 27.43,42.93 | C3.1 27.72,42.63 27.43,42.93 | v21.72,36.83 21.68,36.87 R4.2 22.86,38.1 25.02,35.94 25.02,34.67 27.05,32.64 27.05,31.5 27.94,30.61 27.94,27.05 28.02,26.97 U$5.24 | v26.54,40.51 26.54,42.04 27.43,42.93
  Bottom 0.203: v26.54,40.51 24.64,40.51 22.22,38.1 22.22,37.34 v21.72,36.83
N$16
  Top 0.203: 27.52,32.94 25.53,34.92 25.53,36.2 | R5.2 22.35,40.64 22.86,40.13 22.86,38.86 25.53,36.2 | DZ2.1 28.84,44.57 | 28.84,44.57 28.96,44.45 28.96,44.07 29.59,43.43 29.59,42.8 29.72,42.67 | 29.72,42.67 30.57,42.67 C2.1 | 28.84,44.57 28.95,44.57 29.08,44.7 29.08,46.23 29.72,46.86 DZ3.2 | 29.72,42.67 29.21,42.16 29.21,39.62 28.83,39.24 27.69,39.24 25.53,37.08 25.53,36.2
  Top 0.254: 27.52,32.94 U$5.22
N$17
  Top 0.203: 30.48,33.78 29.59,33.78 29.52,33.71 U$5.18 | 30.48,33.78 30.61,33.78 | 30.61,33.78 31.5,33.78 | 31.5,33.78 32.51,33.78 | 32.51,33.78 33.4,33.78 | 33.4,33.78 33.53,33.78 | 33.53,33.78 34.42,33.78 | 34.42,33.78 35.43,33.78 | 35.43,33.78 36.45,33.78 | 36.45,33.78 37.46,33.78 37.52,33.73 U$5.2 | 36.45,33.78 36.52,33.71 U$5.4 | 35.43,33.78 35.52,33.7 U$5.6 | 34.42,33.78 34.52,33.68 U$5.8 | 33.52,33.77 33.53,33.78 | 30.48,33.78 30.52,33.75 U$5.16 | R7.2 30.61,33.78 | U$5.14 31.52,33.76 31.5,33.78 | U$5.12 32.52,33.78 32.51,33.78 | U$5.10 33.52,33.67 33.4,33.78
N$18  (via drill 0.6)
  Top 0.203: R8.2 33.95,34.96 34.42,35.43 34.42,37.34 33.66,38.1 33.4,38.1 v33.27,38.23 | v23.62,35.81 24.26,35.81 24.38,35.69 24.38,34.54 26.54,32.38 26.54,30.86 27.05,30.35 27.05,27.05 26.8,26.8 26.8,25.53 26.16,24.89 25.02,24.89 24.64,24.51 24.64,18.16 26.29,16.51 Q1.3
  Bottom 0.203: v33.27,38.23 33.27,35.81 33.15,35.69 23.75,35.69 v23.62,35.81
N$19  (via drill 0.6)
  Top 0.203: 39.69,28.51 39.12,29.08 38.99,29.08 37.72,30.35 37.72,31.24 38.02,31.54 U$5.1 | 39.69,28.51 40.89,27.3 40.89,23.75 42.04,22.61 v42.04,22.22 | v42.04,14.1 40.51,14.1 38.61,16 32.89,16 28.57,11.68 27.69,11.68 | 27.69,11.68 R9.2 | C5.2 39.62,28.45 39.69,28.51 | Q1.2 27.24,12.13 27.69,11.68
  Bottom 0.203: v42.04,22.22 42.04,17.53 42.16,17.4 42.16,14.22 v42.04,14.1
N$20
  Top 0.203: Q2.3 21.51,10.46 22.73,11.68 R9.1 25.34,11.71 Q1.1
N$21  (via drill 0.6)
  Top 0.203: U$5.28 30.02,28.87 v30.61,29.46
  Top 0.305: R11.1 23.41,31.88 14.35,31.88 THERM.P$1 13.68,31.2 C7.2
  Bottom 0.203: THERM.P$1 22.48,31.37 25.53,29.08 30.23,29.08 v30.61,29.46
N$22
  Top 0.305: LED2.A R17.1
N$23
  Top 0.305: LED3.A R18.1
N$24
  Top 0.203: U$5.36 34.02,22.75 34.67,22.1 R22.2
N$25
  Top 0.203: U$5.35 33.52,24.12 32.77,23.37 R23.2
N$27
  Top 0.203: U$5.34 33.02,24.76 32.13,23.88 32.13,21.46 30.86,20.19 R24.2
N$28
  Top 0.203: U$5.40 36.02,24.18 37.85,22.35 37.85,20.83 39.88,18.8 45.85,18.8 46.1,19.05 46.1,19.56 47.62,21.08 A3.2
N$29  (via drill 0.6)
  Top 0.203: R3.1 28.07,37.46 v28.19,37.59 | v34.54,39.37 34.54,40.13 34.67,40.26 34.67,46.1 35.31,46.74 36.78,46.74 Q5.1
  Bottom 0.203: v34.54,39.37 32.89,39.37 31.12,37.59 v28.19,37.59
N$30
  Top 0.203: U$5.39 35.52,24.05 37.46,22.1 37.46,20.45 39.62,18.29 47.75,18.29 48.26,17.78 A2.2
N$31
  Top 0.203: U$5.38 35.02,23.79 36.96,21.84 36.96,20.19 39.62,17.53 44.45,17.53 47.5,14.48 A1.2
N$32
  Top 0.203: U$5.37 34.52,23.65 36.45,21.72 36.45,19.94 39.37,17.02 42.29,17.02 48.13,11.18 A0.2
N$33  (via drill 0.6)
  Top 0.203: TOS.2 24.38,26.92 24.13,27.18 22.73,27.18 v22.61,27.3 | v33.02,27.69 32.51,27.69 32,27.18 32,25.72 U$5.32
  Bottom 0.203: v22.61,27.3 26.67,27.3 27.94,28.57 29.84,28.57 30.99,27.43 32.77,27.43 v33.02,27.69
N$34
  Top 0.203: U$5.30 31.02,22 29.84,20.83 29.84,19.3 29.34,18.8 C6.2
PWR  (via drill 0.6)
  Top 0.203: Q2.1 25.25,7.94 R10.2 25.31,8.67 v26.29,9.65
  Bottom 0.203: v26.29,9.65 26.29,9.02 25.53,8.25 25.53,3.43 U$8.D6
SCK  (via drill 0.6)
  Top 0.203: U$5.41 36.52,24.32 38.23,22.61 38.23,21.46 39.5,20.19 39.5,19.94 40.01,19.43 44.07,19.43 v45.47,20.83
  Bottom 0.203: U$8.D13 v45.47,20.83
SCL  (via drill 0.6)
  Top 0.203: U$8.SCL R15.1 | v46.61,6.35 46.61,5.59 44.96,3.94 39.88,3.94 v37.97,5.84
  Bottom 0.203: I2C.P$2 24.89,22.86 25.65,22.1 28.19,22.1 29.34,20.95 36.45,20.95 37.34,20.07 37.34,14.1 38.48,12.95 38.48,6.35 v37.97,5.84 | v46.61,6.35 53.85,6.35 55.63,4.57 U$8.SCL
SDA  (via drill 0.6)
  Top 0.203: U$8.SDA R14.1 48.73,8.04 44.32,12.45 40.26,12.45 38.23,14.48 v38.23,14.99
  Bottom 0.203: I2C.P$1 22.86,25.4 25.78,22.73 28.32,22.73 29.34,21.72 37.72,21.72 38.23,21.21 v38.23,14.99
SS  (via drill 0.6)
  Top 0.203: v40.39,22.48 40.39,23.34 U$5.44
  Bottom 0.203: U$8.D10 37.85,3.43 39.5,5.08 39.5,19.05 39.24,19.3 39.24,21.34 v40.39,22.48
VREG  (via drill 0.6)
  Top 0.203: R11.2 25.65,31.75 25.91,31.5 v25.91,30.1 25.91,29.34 25.23,28.66 C4.1 25.27,28.41 TOS.1 | U$5.31 v31.52,28.32 31.52,30.33 30.99,30.86 v30.23,30.86 | A0.1 47.75,10.29 v47.62,10.41 | v47.75,13.59 A1.1 | A2.1 47.88,16.89 v47.62,16.64 | v47.62,19.56 48.26,20.19 A3.1 51.31,20.19 51.69,20.57 51.69,27.3 v50.42,28.57
  Bottom 0.203: v25.91,30.1 29.46,30.1 v30.23,30.86 | v47.62,10.41 47.62,13.46 v47.75,13.59 47.62,13.72 v47.62,16.64 v47.62,19.56 | v50.42,28.57 31.77,28.57 v31.52,28.32

### Text on the board
tPlace: C3 | C2 | C1 | C0 | SDA | 0 | 1 | SCL | 0 | ESTOP1 | 1 | 0 | ESTOP2 | 1 | 0 | 1 | 0 | 1 | BATT+ | GND | CHGR / IN | VOUT
tNames: ITEST BMS Rev 2